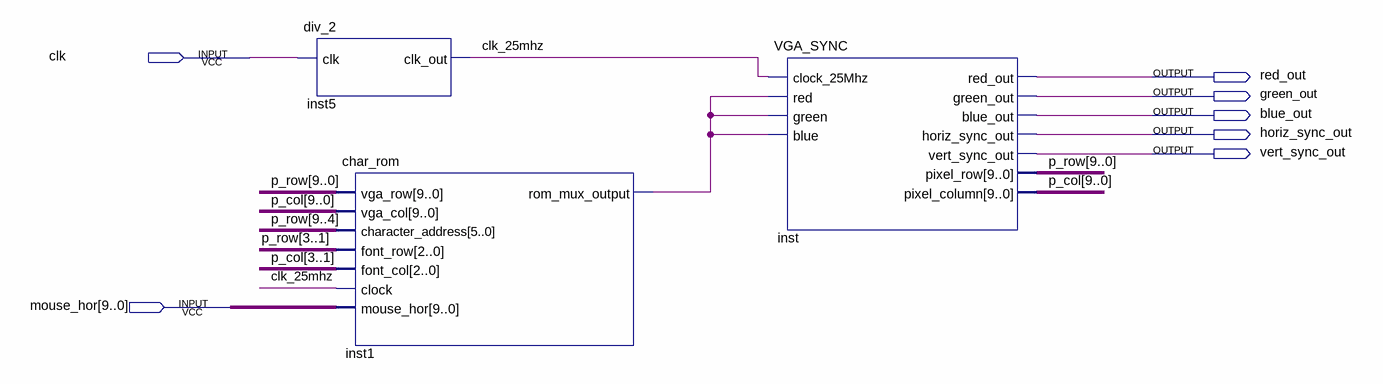
[diagram p0: schematic sheet]
// Quartus schematic output.bdf as structural Verilog: 3 symbols, 7 pins
module \output  (
  input  clk,
  input  [9:0] mouse_hor,
  output red_out,
  output green_out,
  output blue_out,
  output horiz_sync_out,
  output vert_sync_out
);

  wire clk_25mhz, inst1_rom_mux_output;
  wire [9:0] p_col, p_row;

  div_2 inst5 (.clk(clk), .clk_out(clk_25mhz));
  char_rom inst1 (
    .vga_row(p_row), .vga_col(p_col), .character_address(p_row[9:4]), .font_row(p_row[3:1]),
    .font_col(p_col[3:1]), .clock(clk_25mhz), .mouse_hor(mouse_hor), .rom_mux_output(inst1_rom_mux_output));
  VGA_SYNC inst (
    .clock_25Mhz(clk_25mhz), .red(inst1_rom_mux_output), .green(inst1_rom_mux_output),
    .blue(inst1_rom_mux_output), .red_out(red_out), .green_out(green_out), .blue_out(blue_out),
    .horiz_sync_out(horiz_sync_out), .vert_sync_out(vert_sync_out), .pixel_row(p_row), .pixel_column(p_col));
endmodule
